# EAGLE schematic schematic (EAGLE 7.3.0)
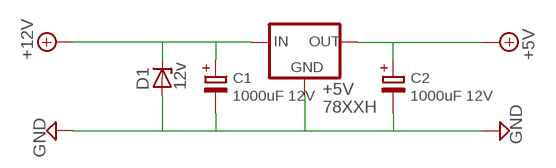
[diagram p0: schematic, sheet 1]

## Parts
+5V  78XXH  [TO220BH]
C1  1000uF 12V  CAPD10L5  [CAPD10L5]
C2  1000uF 12V  CAPD10L5  [CAPD10L5]
D1  12v  ZENER-DIODEDO34-7  [DO34Z7]

## Nets
+5V: +5V.S(OUT) C2.1(+)
+12V: +5V.G(IN)
N$6: C2.2(-)
N$7: +5V.D(GND)
N$8: C1.2(-)
N$9: D1.A
N$10: D1.C
N$11: C1.1(+)

## Library data of the parts
+5V = ads4:78XX: Linear voltage regulator
C1 C2 = ADS:CAPD10L5
D1 = diode:ZENER-DIODE: Z-Diode